# Altium schematic sheet GTM_MainBoard.SchDoc
size A4
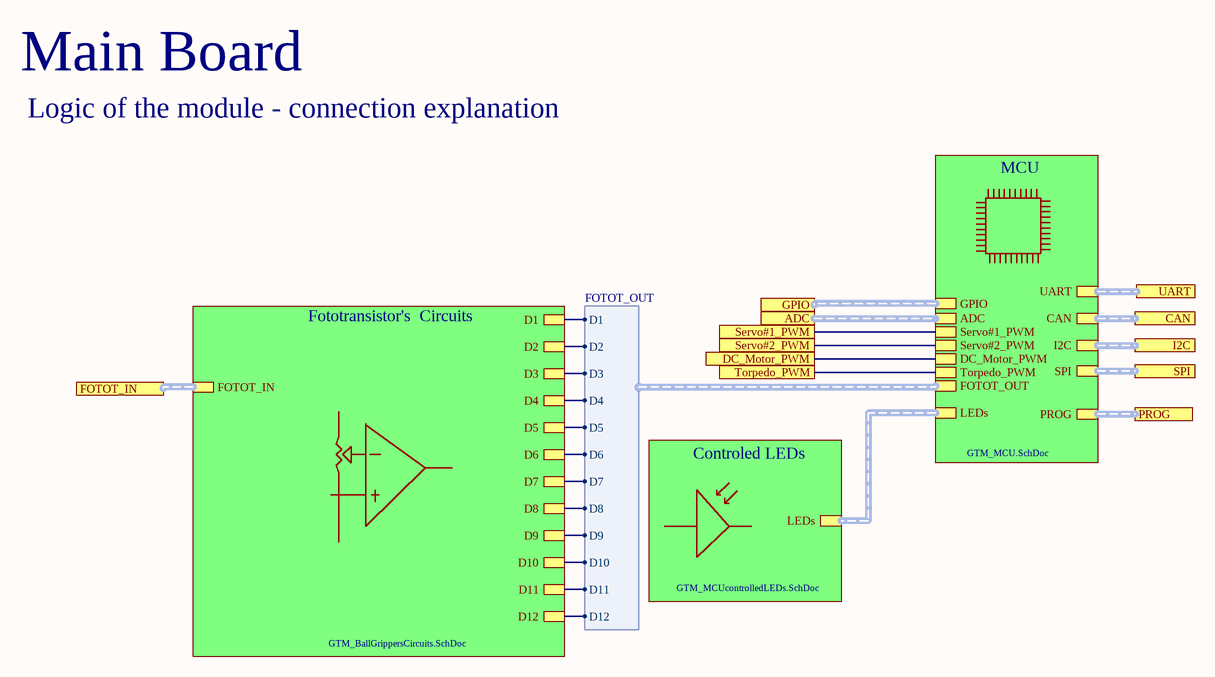
[diagram p0: GTM_MainBoard.SchDoc]

## Sub-sheets
Controled LEDs = GTM_MCUcontrolledLEDs.SchDoc: LEDs
Fototransistor's  Circuits = GTM_BallGrippersCircuits.SchDoc: FOTOT_IN (harness Harness), D1, D2, D3, D4, D5, D6, D7, D8, D9, D10, D11, D12
MCU = GTM_MCU.SchDoc: ADC, GPIO, UART, CAN, I2C, SPI, PROG, LEDs, Servo#1_PWM, Servo#2_PWM, DC_Motor_PWM, Torpedo_PWM, FOTOT_OUT (harness FOTOT_OUT)

## Ports
ADC, CAN, DC_Motor_PWM, FOTOT_IN, GPIO, I2C, PROG, Servo#1_PWM, Servo#2_PWM, SPI, Torpedo_PWM, UART

## Harnesses
FOTOT_OUT: D1, D2, D3, D4, D5, D6, D7, D8, D9, D10, D11, D12

## Nets
DC_Motor_PWM: port DC_Motor_PWM, sheet MCU/DC_Motor_PWM
Servo#1_PWM: port Servo#1_PWM, sheet MCU/Servo#1_PWM
Servo#2_PWM: port Servo#2_PWM, sheet MCU/Servo#2_PWM
Torpedo_PWM: port Torpedo_PWM, sheet MCU/Torpedo_PWM
(unnamed): sheet Fototransistor's  Circuits/D1, sheet MCU/FOTOT_OUT.D1
(unnamed): sheet Fototransistor's  Circuits/D2, sheet MCU/FOTOT_OUT.D2
(unnamed): sheet Fototransistor's  Circuits/D3, sheet MCU/FOTOT_OUT.D3
(unnamed): sheet Fototransistor's  Circuits/D4, sheet MCU/FOTOT_OUT.D4
(unnamed): sheet Fototransistor's  Circuits/D5, sheet MCU/FOTOT_OUT.D5
(unnamed): sheet Fototransistor's  Circuits/D6, sheet MCU/FOTOT_OUT.D6
(unnamed): sheet Fototransistor's  Circuits/D7, sheet MCU/FOTOT_OUT.D7
(unnamed): sheet Fototransistor's  Circuits/D8, sheet MCU/FOTOT_OUT.D8
(unnamed): sheet Fototransistor's  Circuits/D9, sheet MCU/FOTOT_OUT.D9
(unnamed): sheet Fototransistor's  Circuits/D10, sheet MCU/FOTOT_OUT.D10
(unnamed): sheet Fototransistor's  Circuits/D11, sheet MCU/FOTOT_OUT.D11
(unnamed): sheet Fototransistor's  Circuits/D12, sheet MCU/FOTOT_OUT.D12

## Buses and harness runs
harness port ADC = sheet MCU/ADC
harness port CAN = sheet MCU/CAN
harness port FOTOT_IN = sheet Fototransistor's  Circuits/FOTOT_IN
harness port GPIO = sheet MCU/GPIO
harness port I2C = sheet MCU/I2C
harness port PROG = sheet MCU/PROG
harness port SPI = sheet MCU/SPI
harness port UART = sheet MCU/UART
harness sheet Controled LEDs/LEDs = sheet MCU/LEDs

## Notes on the sheet
- Main Board
- Logic of the module - connection explanation
- Project
- Rev.
- Title
- Drawn by
- Date
- Sheet
- of
- Checked by